# Altium schematic sheet PWR_5to-5_MAX755.SchDoc
size A4
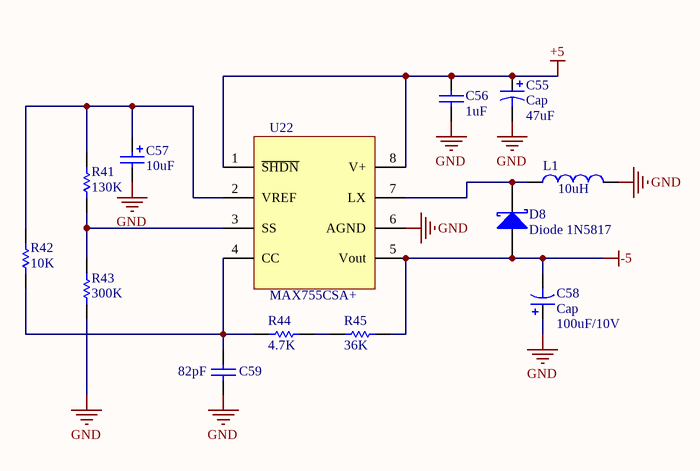
[diagram p0: PWR_5to-5_MAX755.SchDoc]

## Parts
C55  Cap  value 47uF  [1206(pol)]
C56  value 1uF  [C1206]  (hidden comment: Cap)
C57  value 10uF  [1206(pol)]  (hidden comment: Cap Pol)
C58  Cap  value 100uF/10V  [1206(pol)]
C59  value 82pF  [C1206]  (hidden comment: Cap)
D8  Diode 1N5817  [DIODE-SMA]
L1  value 10uH  [1210]  (hidden comment: Inductor(1210))
R41  value 130K  [1206]  (hidden comment: Res)
R42  value 10K  [1206]  (hidden comment: Res)
R43  value 300K  [1206]  (hidden comment: Res)
R44  value 4.7K  [1206]  (hidden comment: Res)
R45  value 36K  [1206]  (hidden comment: Res)
U22  MAX755CSA+  [SOIC-8]  (value not drawn)

## Nets
+5: C55.1 C56.2 U22.1(~{SHDN}) U22.8(V+)
-5: C58.2 D8.3(A) R45.1 U22.5(Vout)
GND: C55.2 C56.1 C57.2 C58.1 C59.1 L1.2 R43.1 U22.6(AGND)
NetC57_1: C57.1 R41.2 R42.2 U22.2(VREF)
NetC59_2: C59.2 R42.1 R44.2 U22.4(CC)
NetD8_1: D8.1(K) L1.1 U22.7(LX)
NetR41_1: R41.1 R43.2 U22.3(SS)
NetR44_1: R44.1 R45.2

## Library data of the parts
C55 C58 = Cap Pol1: Polarized Capacitor (Radial); Published: 8-Jun-2000; LatestRevisionDate: 17-Jul-2002; LatestRevisionNote: Re-released for DXP Platform.; PackageReference: RB7.6-15; Publisher: Altium Limited; PackageDescription: Polarized Capacitor (Radial); 2 Leads
C56 C59 = Cap: Capacitor; Published: 8-Jun-2000; LatestRevisionDate: 17-Jul-2002; LatestRevisionNote: Re-released for DXP Platform.; Publisher: Altium Limited
C57 = Cap Pol: Polarized Capacitor (Radial); Published: 8-Jun-2000; LatestRevisionDate: 17-Jul-2002; LatestRevisionNote: Re-released for DXP Platform.; Publisher: Altium Limited
D8 = Diode 10TQ045: Schottky Rectifier; pin to pad: 3>2; Note: Terminal 2 is the TAB and is electrically connected to the cathode; Published: 8-Jun-2000; LatestRevisionDate: 17-Jul-2002; LatestRevisionNote: Re-released for DXP Platform.; DatasheetVersion: PD-2.057B; PackageVersion: Feb-1998; PackageReference: TO-220AC; Publisher: Altium Limited; PackageDescription: TO, Thru-Hole, Vertical, Heatsink Mounted; 3 In-Line Leads (1 Absent); Pitch 2.54 mm; ComponentLink1Description: Manufacturer Link; ComponentLink1URL: http://www.irf.com/; ComponentLink2Description: Datasheet; ComponentLink2URL: http://www.irf.com/product-info/datasheets/data/10tq.pdf
L1 = Inductor(1210): Inductor; Code_IEC: 1005; Published: 8-Jun-2000; LatestRevisionDate: 29-May-2009; LatestRevisionNote: IPC-7351 Footprint Added.; PackageReference: 0402-A; Publisher: Altium Limited; PackageDescription: Chip Inductor; Code_JEITA: 0402
R41-R45 = Res1206: Resistor; Published: 8-Jun-2000; LatestRevisionDate: 17-Jul-2002; LatestRevisionNote: Re-released for DXP Platform.; Publisher: Altium Limited
U22 = MAX755CSA+: VOLTAGE INVERTING